# Altium schematic sheet STM32F103.SchDoc
size A4
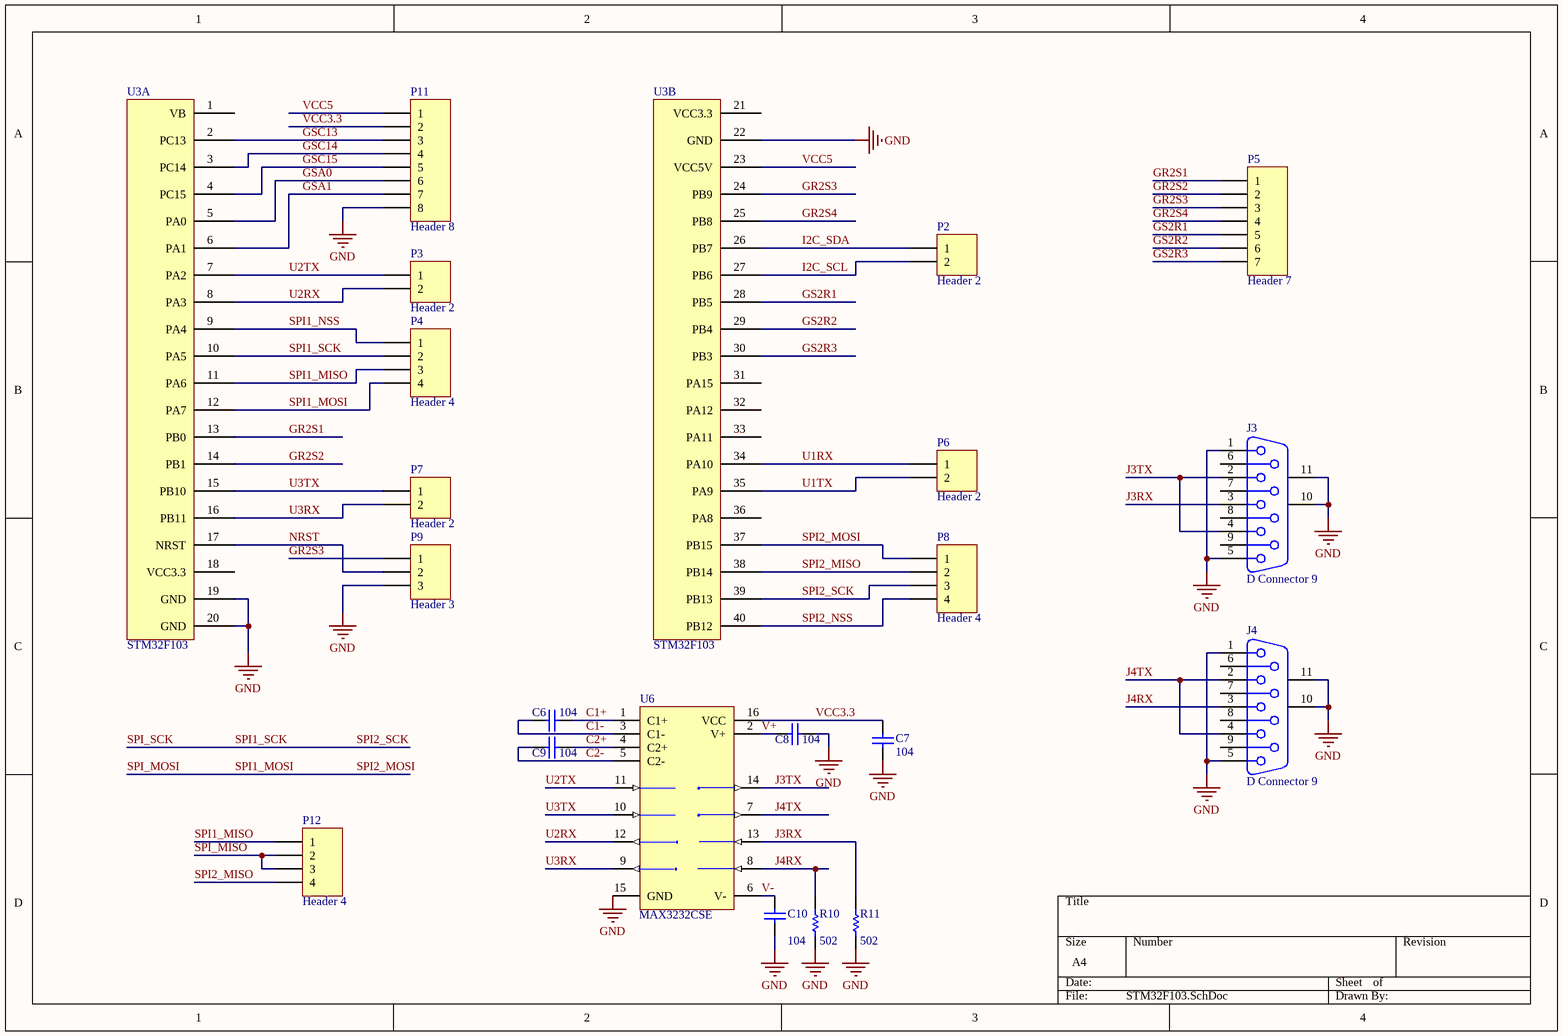
[diagram p0: STM32F103.SchDoc]

## Parts
C6  value 104  [CAPC3216L]  (hidden comment: Cap Semi)
C7  value 104  [CAPC3216L]  (hidden comment: Cap Semi)
C8  value 104  [CAPC3216L]  (hidden comment: Cap Semi)
C9  value 104  [CAPC3216L]  (hidden comment: Cap Semi)
C10  value 104  [CAPC3216L]  (hidden comment: Cap Semi)
J3  D Connector 9  [DSUB1.385-2H9]
J4  D Connector 9  [DSUB1.385-2H9]
P2  Header 2  [HDR1X2]
P3  Header 2  [HDR1X2]
P4  Header 4  [HDR1X4]
P5  Header 7  [HDR1X7]
P6  Header 2  [HDR1X2]
P7  Header 2  [HDR1X2]
P8  Header 4  [HDR1X4]
P9  Header 3  [HDR1X3]
P11  Header 8  [HDR1X8]
P12  Header 4  [HDR1X4]
R10  value 502  [RESC3216L]  (hidden comment: Res Semi)
R11  value 502  [RESC3216L]  (hidden comment: Res Semi)
U3  STM32F103  [STM32F103C8T6]  (parts A,B of 2)
U6  MAX3232CSE  [NSO16_N]

## Nets
GND: C7.2 C8.1 C10.1 J3.1 J3.5 J3.10(MH1) J3.11(MH2) J4.1 J4.5 J4.10(MH1) J4.11(MH2) P9.3 P11.8 R10.1 R11.1 U3.19(GND) U3.20(GND) U3.22(GND) U6.15(GND)
C1+: C6.1 U6.1(C1+)
C1-: C6.2 U6.3(C1-)
C2+: C9.1 U6.4(C2+)
C2-: C9.2 U6.5(C2-)
GR2S1: P5.1 U3.13(PB0)
GR2S2: P5.2 U3.14(PB1)
GR2S3: P5.3 P9.1 U3.24(PB9)
GR2S4: P5.4 U3.25(PB8)
GS2R1: P5.5 U3.28(PB5)
GS2R2: P5.6 U3.29(PB4)
GS2R3: P5.7 U3.30(PB3)
GSA0: P11.6 U3.5(PA0)
GSA1: P11.7 U3.6(PA1)
GSC13: P11.3 U3.2(PC13)
GSC14: P11.4 U3.3(PC14)
GSC15: P11.5 U3.4(PC15)
I2C_SCL: P2.2 U3.27(PB6)
I2C_SDA: P2.1 U3.26(PB7)
J3RX: J3.3 R11.2 U6.13(R1IN)
J3TX: J3.2 J3.4 U6.14(T1OUT)
J4RX: J4.3 R10.2 U6.8(R2IN)
J4TX: J4.2 J4.4 U6.7(T2OUT)
NRST: P9.2 U3.17(NRST)
SPI1_MISO: P4.3 P12.1 U3.11(PA6)
SPI1_MOSI: P4.4 P8.1 U3.12(PA7) U3.37(PB15)  [also labelled SPI2_MOSI, SPI_MOSI]
SPI1_NSS: P4.1 U3.9(PA4)
SPI1_SCK: P4.2 P8.3 U3.10(PA5) U3.39(PB13)  [also labelled SPI2_SCK, SPI_SCK]
SPI2_MISO: P8.2 P12.4 U3.38(PB14)
SPI2_NSS: P8.4 U3.40(PB12)
SPI_MISO: P12.2 P12.3
U1RX: P6.1 U3.34(PA10)
U1TX: P6.2 U3.35(PA9)
U2RX: P3.2 U3.8(PA3) U6.12(R1OUT)
U2TX: P3.1 U3.7(PA2) U6.11(T1IN)
U3RX: P7.2 U3.16(PB11) U6.9(R2OUT)
U3TX: P7.1 U3.15(PB10) U6.10(T2IN)
V+: C8.2 U6.2(V+)
V-: C10.2 U6.6(V-)
VCC3.3: C7.1 P11.2 U6.16(VCC)
VCC5: P11.1 U3.23(VCC5V)

Not connected (* = marked no-connect by the designer): J3 6 7 8 9; J4 6 7 8 9; U3 1(VB) 18(VCC3.3) 21(VCC3.3) 31(PA15) 32(PA12) 33(PA11) 36(PA8)

## Library data of the parts
C6-C10 = Cap Semi: Capacitor (Semiconductor SIM Model); Published: 8-Jun-2000; LatestRevisionDate: 29-May-2009; LatestRevisionNote: IPC-7351 Footprint Added.; PackageReference: C1206; Publisher: Altium Limited; PackageDescription: Chip Capacitor
J3 J4 = D Connector 9: Receptacle Assembly, 9 Position, Right Angle; PackageDocument: O; Positions: 9; Published: 15-Jun-2001; LatestRevisionDate: 17-Jul-2002; LatestRevisionNote: Re-released for DXP Platform.; DatasheetDocument: 1-Sep-1999; PackageReference: 788750; Publisher: Altium Limited; Orientation: Right Angle; Gender: Receptacle
P2 P3 P6 P7 = Header 2: Header, 2-Pin; LatestRevisionDate: 17-Jul-2002; LatestRevisionNote: Re-released for DXP Platform.; Publisher: Altium Limited
P4 P8 P12 = Header 4: Header, 4-Pin; LatestRevisionDate: 17-Jul-2002; LatestRevisionNote: Re-released for DXP Platform.; Publisher: Altium Limited
P5 = Header 7: Header, 7-Pin; LatestRevisionDate: 17-Jul-2002; LatestRevisionNote: Re-released for DXP Platform.; Publisher: Altium Limited
P9 = Header 3: Header, 3-Pin; LatestRevisionDate: 17-Jul-2002; LatestRevisionNote: Re-released for DXP Platform.; Publisher: Altium Limited
P11 = Header 8: Header, 8-Pin; LatestRevisionDate: 17-Jul-2002; LatestRevisionNote: Re-released for DXP Platform.; Publisher: Altium Limited
R10 R11 = Res Semi: Semiconductor Resistor; Published: 8-Jun-2000; LatestRevisionDate: 17-Jul-2002; LatestRevisionNote: Re-released for DXP Platform.; PackageReference: AXIAL-0.5; Publisher: Altium Limited
U3 = STM32F103C8T6
U6 = MAX3232CSE: 3.0V TO 5.5V, Low-Power, up to 1Mbps, True RS-232 Transceiver Using Four 0.1µF External Capacitor; Published: 16-Jan-2001; LatestRevisionDate: 13-Apr-2006; LatestRevisionNote: IPC-7351 Footprint Added.; DatasheetVersion: Mar-1999; PackageReference: NSO16; Publisher: Altium Limited; PackageDescription: 16-Pin Small Outline Integrated Circuit 1.27 mm Pitch; Code_JEDEC: MS-012-AC; Code_IPC: SOIC127P600-16; ComponentLink1Description: Manufacturer Link; ComponentLink1URL: http://www.maxim-ic.com/; ComponentLink2Description: Datasheet; ComponentLink2URL: http://pdfserv.maxim-ic.com/en/ds/MAX3222-MAX3241.pdf